# Altium project EnergyMeter_TEMPLATE_ONLY.PrjPcb
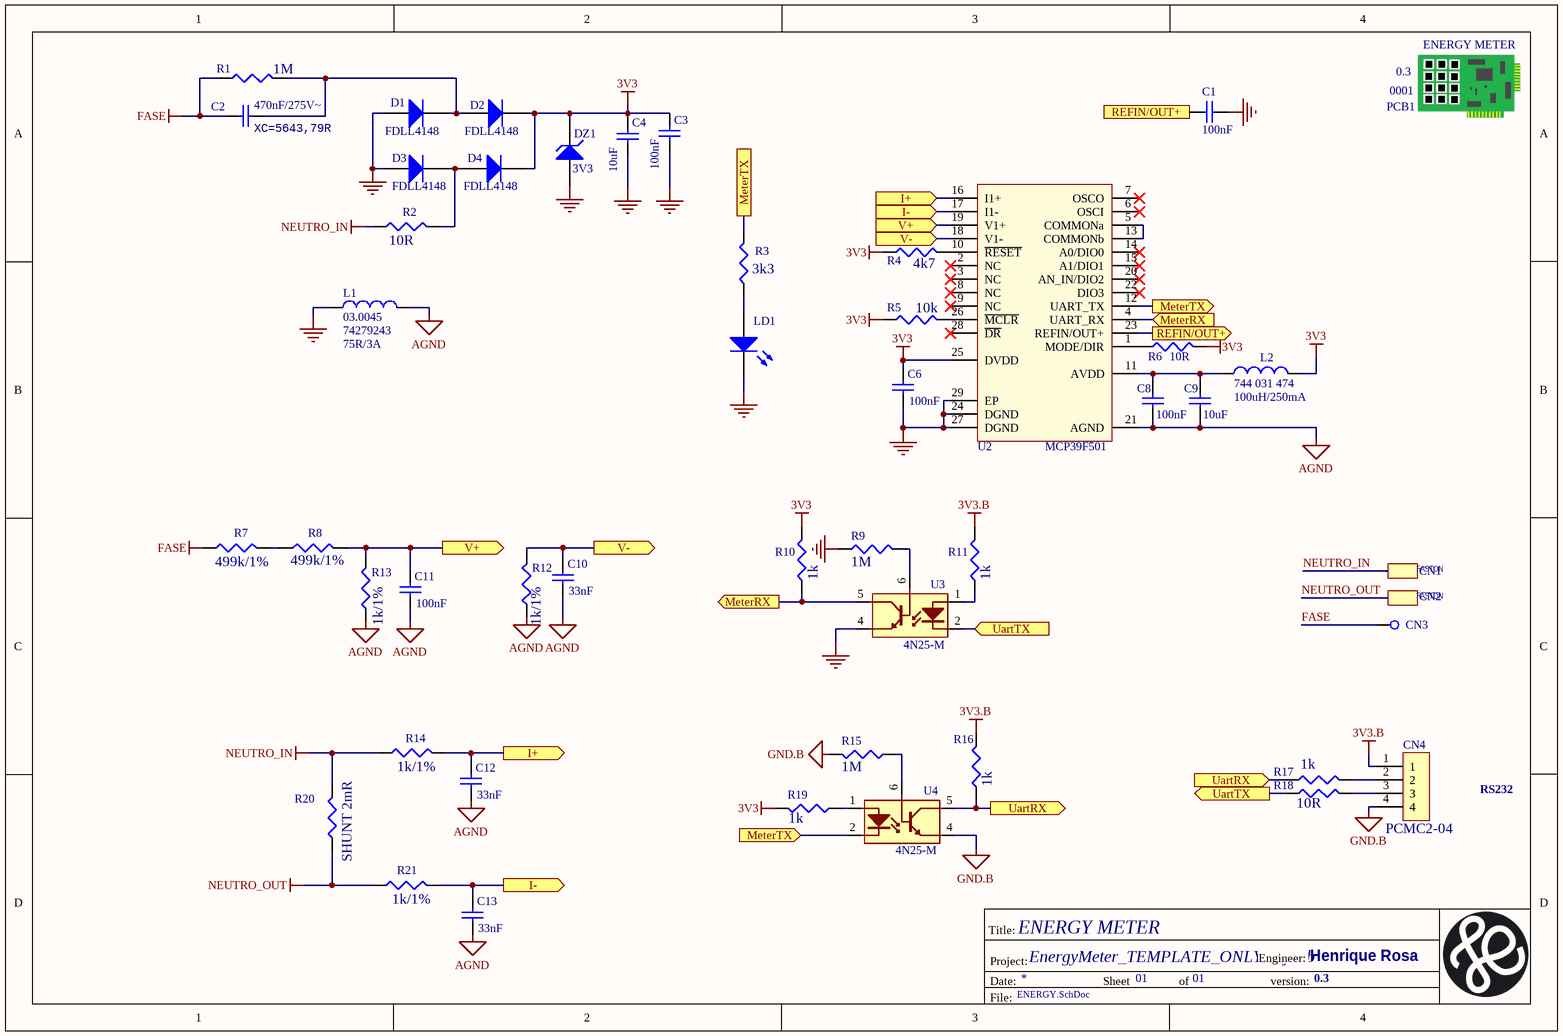
[diagram p0: ENERGY.SchDoc]
CurrentDateUser: dd/mm/yyyy
1 sheet, 48 parts. Net scope: flat (ports and power ports of the same name join across sheets).
Board file: 0001 EnergyMeter.PcbDoc

## Sheet ENERGY.SchDoc: ENERGY METER
size A4; Author: Henrique Rosa; DrawnBy: Henq; Engineer: Henrique Rosa; Address1: rua; Address: Bairro; Address3: São Paulo, SP - Brasil; Address4: 55 (11) 9 6825-6715; DocumentNumber: 178XXX EnergyMeter; Revision: 0.3; SheetNumber: 01; SheetTotal: 01; Site: henq.com; VersionControl_RevNumber: 03; PageSetup: Record=PageOptions|CenterHorizontal=True|CenterVertical=True|PrintScale=0.98|XCorrection=1.00|YCorrection=1.00|PrintKind=0|BorderSize=5000000|LeftOffset=0|BottomOffset=0|Orientation=2|PaperLength=1000|PaperWidth=1000|Scale=100|PaperSource=7|PrintQuality=-3|MediaType=1|DitherType=10|PrintScaleMode=1|PaperKind=A4|PaperIndex=9

### Parts
C1  Valor: 100nF  [0603 - CAP - montagem na maquina]  (hidden comment: Capacitor Cerâmico SMD)
C2  Valor: 470nF/275V~  [cap 470nF / 275V~]  (hidden comment: 02.0032)
C3  Valor: 100nF  [0603 - CAP - montagem na maquina]  (hidden comment: Capacitor Cerâmico SMD)
C4  Valor: 10uF  [0603 - CAP - montagem na maquina]  (hidden comment: Capacitor Cerâmico SMD)
C6  Valor: 100nF  [0603 - CAP - montagem na maquina]  (hidden comment: Capacitor Cerâmico SMD)
C8  Valor: 100nF  [0603 - CAP - montagem na maquina]  (hidden comment: Capacitor Cerâmico SMD)
C9  Valor: 10uF  [0805(cap)]  (hidden comment: Capacitor Cerâmico SMD)
C10  Valor: 33nF  [0603 - CAP - montagem na maquina]  (hidden comment: Capacitor Cerâmico SMD)
C11  Valor: 100nF  [0603 - CAP - montagem na maquina]  (hidden comment: Capacitor Cerâmico SMD)
C12  Valor: 33nF  [0603 - CAP - montagem na maquina]  (hidden comment: Capacitor Cerâmico SMD)
C13  Valor: 33nF  [0603 - CAP - montagem na maquina]  (hidden comment: Capacitor Cerâmico SMD)
CN1  5mm  [FASTON FEMALE 180G]  (value not drawn)
CN2  5mm  [FASTON FEMALE 180G]  (value not drawn)
CN3  ##nl  [Testpoint-1mm]  (value not drawn)
CN4  11.0417  [PCMC2-04]  (value not drawn)
D1  Part Number: FDLL4148  [DIODE_SMD_2mm]  (hidden comment: Diode)
D2  Part Number: FDLL4148  [DIODE_SMD_2mm]  (hidden comment: Diode)
D3  Part Number: FDLL4148  [DIODE_SMD_2mm]  (hidden comment: Diode)
D4  Part Number: FDLL4148  [DIODE_SMD_2mm]  (hidden comment: Diode)
DZ1  value 3V3  [DIODE_SMD_2mm]  (hidden comment: Zener Diode)
L1  03.0045  Part number: 74279243  Valor: 75R/3A  [1806 ind WURTH]
L2  Part number: 744 031 474  Valor: 100uH/250mA  [744031100]  (hidden comment: 03.0105)
LD1  LED2  [LED 0805]  (value not drawn)
PCB1  0001  Rev: 0.3  Valor: ENERGY METER  (graphical)
R1  Valor: 1M  [0603 - MONTAGEM MÁQUINA]  (hidden comment: Res3)
R2  Valor: 10R  [0603 - MONTAGEM MÁQUINA]  (hidden comment: Res3)
R3  Valor: 3k3  [0603 - MONTAGEM MÁQUINA]  (hidden comment: Res3)
R4  Valor: 4k7  [0603 - MONTAGEM MÁQUINA]  (hidden comment: Res3)
R5  Valor: 10k  [0603 - MONTAGEM MÁQUINA]  (hidden comment: Res3)
R6  Valor: 10R  [0603 - MONTAGEM MÁQUINA]  (hidden comment: Res3)
R7  Valor: 499k/1%  [0603 - MONTAGEM MÁQUINA]  (hidden comment: Res3)
R8  Valor: 499k/1%  [0603 - MONTAGEM MÁQUINA]  (hidden comment: Res3)
R9  Valor: 1M  [0603 - MONTAGEM MÁQUINA]  (hidden comment: Res3)
R10  Valor: 1k  [0603 - MONTAGEM MÁQUINA]  (hidden comment: Res3)
R11  Valor: 1k  [0603 - MONTAGEM MÁQUINA]  (hidden comment: Res3)
R12  Valor: 1k/1%  [0603 - MONTAGEM MÁQUINA]  (hidden comment: Res3)
R13  Valor: 1k/1%  [0603 - MONTAGEM MÁQUINA]  (hidden comment: Res3)
R14  Valor: 1k/1%  [0603 - MONTAGEM MÁQUINA]  (hidden comment: Res3)
R15  Valor: 1M  [0603 - MONTAGEM MÁQUINA]  (hidden comment: Res3)
R16  Valor: 1k  [0603 - MONTAGEM MÁQUINA]  (hidden comment: Res3)
R17  Valor: 1k  [0603 - MONTAGEM MÁQUINA]  (hidden comment: Res3)
R18  Valor: 10R  [0603 - MONTAGEM MÁQUINA]  (hidden comment: Res3)
R19  Valor: 1k  [0603 - MONTAGEM MÁQUINA]  (hidden comment: Res3)
R20  Valor: SHUNT 2mR  [2512]  (hidden comment: Res3)
R21  Valor: 1k/1%  [0603 - MONTAGEM MÁQUINA]  (hidden comment: Res3)
U2  07.1140  [QFN 5x5]  (value not drawn)
U3  Part number: 4N25-M  [DIP 6 BRANCO M SUFFIX]  (hidden comment: 07.0195)
U4  Part number: 4N25-M  [DIP 6 BRANCO M SUFFIX]  (hidden comment: 07.0195)

### Ports
I+ (in), I+ (out), I- (in), I- (out), MeterRX (in), MeterRX (out), MeterTX, MeterTX (in), MeterTX (out), REFIN/OUT+ (out), UartRX (in), UartRX (out), UartTX (in), UartTX (out), V+ (in), V+ (out), V- (in), V- (out)

### Nets
3V3: C3.2 C4.2 C6.2 D2.2(K) D4.2(K) DZ1.2(K) L2.2 R4.1 R5.1 R6.1 R10.1 R19.1 U2.25(DVDD)
3V3.B: CN4.1 R11.1 R16.1
AGND: C8.1 C9.1 C10.1 C11.1 C12.1 C13.1 L1.2 R12.1 R13.1 U2.21(AGND)
EARTH: C1.1 C3.1 C4.1 C6.1 D1.1(A) D3.1(A) DZ1.1(A) L1.1 LD1.2(K) R9.2 U2.24(DGND) U2.27(DGND) U2.29(EP) U3.4(E)
FASE: C2.1 CN3.1 R1.1 R7.1
GND.B: CN4.4 R15.1 U4.4(E)
NEUTRO_IN: CN1.1 R2.1 R14.1 R20.2
NEUTRO_OUT: CN2.1 R20.1 R21.1
NetC1_2: C1.2 U2.23(REFIN/OUT+) ; port REFIN/OUT+
NetC2_2: C2.2 D1.2(K) D2.1(A) R1.2
NetC8_2: C8.2 C9.2 L2.1 U2.11(AVDD)
NetC10_2: C10.2 R12.2 U2.18(V1-) ; port V-
NetC11_2: C11.2 R8.2 R13.2 U2.19(V1+) ; port V+
NetC12_2: C12.2 R14.2 U2.16(I1+) ; port I+
NetC13_2: C13.2 R21.2 U2.17(I1-) ; port I-
NetCN4_2: CN4.2 R17.1
NetCN4_3: CN4.3 R18.1
NetD3_2: D3.2(K) D4.1(A) R2.2
NetLD1_1: LD1.1(A) R3.1
NetR3_2: R3.2 U2.12(UART_TX) U4.2(K) ; port MeterTX
NetR4_2: R4.2 U2.10(~{RESET})
NetR5_2: R5.2 U2.26(~{MCLR})
NetR6_2: R6.2 U2.1(MODE/DIR)
NetR7_2: R7.2 R8.1
NetR9_1: R9.1 U3.6(B)
NetR10_2: R10.2 U2.4(UART_RX) U3.5(C) ; port MeterRX
NetR11_2: R11.2 U3.1(A)
NetR15_2: R15.2 U4.6(B)
NetR16_2: R16.2 R17.2 U4.5(C) ; port UartRX
NetR18_2: R18.2 U3.2(K) ; port UartTX
NetR19_2: R19.2 U4.1(A)
NetU2_5: U2.5(COMMONa) U2.13(COMMONb)

Not connected (* = marked no-connect by the designer): U2 2(NC)* 3(NC)* 6(OSCI)* 7(OSCO)* 8(NC)* 9(NC)* 14(A0/DIO0)* 15(A1/DIO1)* 20(AN_IN/DIO2)* 22(DIO3)* 28(~{DR})*

### Notes on the sheet
- (near C2) XC=5643,79R
- (near CN4) RS232
- Title:
- Project:
- Date:
- Sheet
- of
- Engineer:
- version:
- File:
- Title
- Size:
- A4
- Number:
- Time:
- Revision:
- (in symbol FASTON FEMEA 180G) FASTON

### Library data of the parts
C1 C3 C4 C6 C8 C11 = Capacitor Cerâmico SMD: cod.: 186030
C2 = cap 220nF / 400V: Capacitor de Poliéster - MKP; Grupo: 02; cod.: 128081; Fornecedor: *; Fabricante: *
C9 = Capacitor Cerâmico SMD: cod.: ?????
C10 C12 C13 = Capacitor Cerâmico SMD: cod.: 186230
CN1 CN2 = FASTON FEMEA 180G: Faston Fêmea 90graus; cod.: 89240
CN3 = TESTPOINT
CN4 = PCMC2-04: Conector header; Fabricante: METALTEX; Encapsulamento: 2,54mm - 180º; Valor: 4 vias; Grupo: 11; cod.: 52312; Datasheet: *; Obs: *; Part number: PCMC2-04
D1-D4 = Diode: Default Diode; LatestRevisionDate: 17-Jul-2002; LatestRevisionNote: Re-released for DXP Platform.; PackageDocument: Sep-1996; PackageReference: SMC; Code_JEDEC: DO-214-AB; Value: value
DZ1 = Diode Zener: Part Number: MMSZ5231B; LatestRevisionDate: 17-Jul-2002; LatestRevisionNote: Re-released for DXP Platform.; PackageReference: SOD123
L1 = 742 792 43: Indutor; Encapsulamento: 1806; Fabricante: WURTH ELEKTRONIK; Fornecedor: BEVIAN; cod.: 87011; Datasheet: \\SERVIDOR\Arquivo\Eletronica\Componentes\74476604.pdf
L2 = 744 031 101: Indutor; Fabricante: WURTH ELEKTRONIK; Fornecedor: BEVIAN; cod.: 122021; Datasheet: \\SERVIDOR\Arquivo\Eletronica\Componentes\74476604.pdf
LD1 = LED2: Led; Valor: LED AZUL; Encapsulamento: 0805; Grupo: 09; cod.: 190020
PCB1 = PCI: =ProjectName
R1 = Res3: Resistor; Grupo: 01; cod.: 185200
R2 R7 R8 R12-R14 R21 = Res3: Resistor; Grupo: 01
R3 = Res3: Resistor; Grupo: 01; cod.: 185250
R4 R5 = Res3: Resistor; Grupo: 01; cod.: 185070
R6 R17 R18 = Res3: Resistor; Encapsulamento: 0603; Grupo: 01
R9-R11 R15 R16 R19 = Res3: Resistor; Encapsulamento: 0603; Grupo: 01; Cod. Savage: 185050
R20 = Res3: Resistor; Encapsulamento: 1206; Grupo: 01
U2 = MCP39F501: Energy Meter; Grupo: 07; Fabricante: Microchip; Part Number: MCP39F501; Valor: *; Obs: *
U3 U4 = OPTO 4N25-M: Optoacoplador(Branco); Encapsulamento: DIP-6; Fabricante: FAIRCHILD; Fornecedor: INTERTEK; Grupo: 07